# Altium schematic sheet Sheet_1_2023-04-21_Altium.schdoc
size 238 x 238 mm
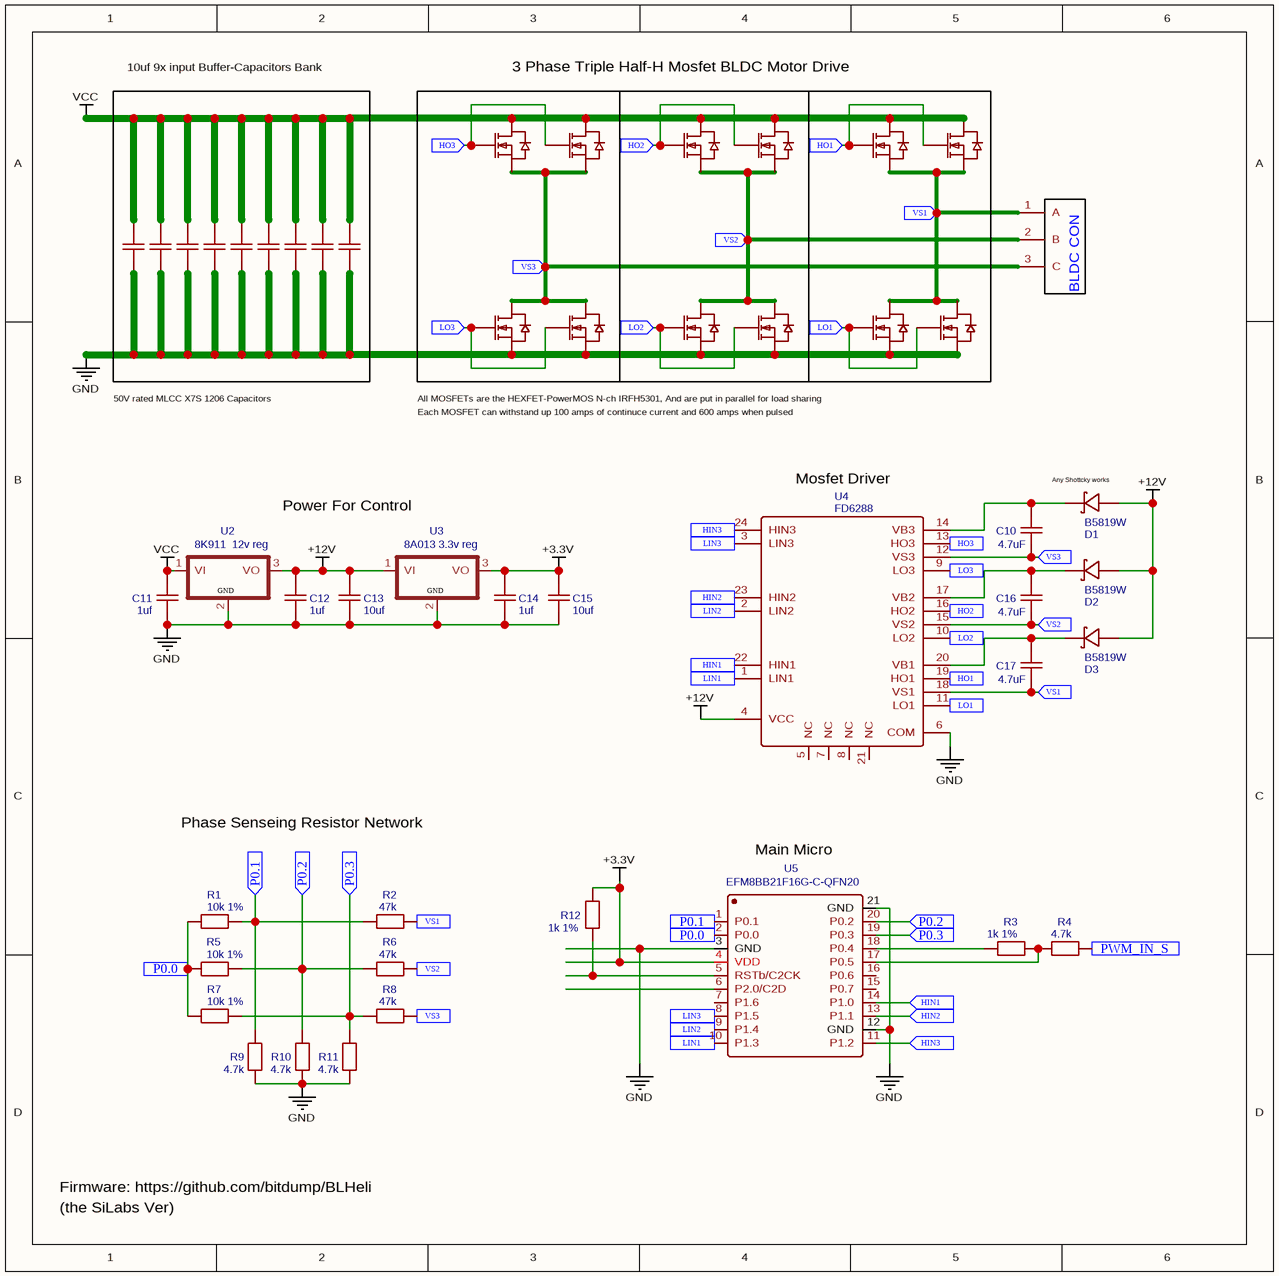
[diagram p0: Sheet_1_2023-04-21_Altium.schdoc]

## Parts
C1  10uf  [C0603]  (value not drawn)
C2  10uf  [C0603]  (value not drawn)
C3  10uf  [C0603]  (value not drawn)
C4  10uf  [C0603]  (value not drawn)
C5  10uf  [C0603]  (value not drawn)
C6  10uf  [C0603]  (value not drawn)
C7  10uf  [C0603]  (value not drawn)
C8  10uf  [C0603]  (value not drawn)
C9  10uf  [C0603]  (value not drawn)
C10  4.7uF  [C1206]
C11  1uf  [C0603]
C12  1uf  [C0603]
C13  10uf  [C0603]
C14  1uf  [C0603]
C15  10uf  [C0603]
C16  4.7uF  [C1206]
C17  4.7uF  [C1206]
D1  B5819W  [SOD-123_L2.8-W1.8-LS3.7-RD]
D2  B5819W  [SOD-123_L2.8-W1.8-LS3.7-RD]
D3  B5819W  [SOD-123_L2.8-W1.8-LS3.7-RD]
Q1  IRFH5301  [PQFN-5X6MM]  (value not drawn)
Q2  IRFH5301  [PQFN-5X6MM]  (value not drawn)
Q3  IRFH5301  [PQFN-5X6MM]  (value not drawn)
Q4  IRFH5301  [PQFN-5X6MM]  (value not drawn)
Q5  IRFH5301  [PQFN-5X6MM]  (value not drawn)
Q6  IRFH5301  [PQFN-5X6MM]  (value not drawn)
Q7  IRFH5301  [PQFN-5X6MM]  (value not drawn)
Q8  IRFH5301  [PQFN-5X6MM]  (value not drawn)
Q9  IRFH5301  [PQFN-5X6MM]  (value not drawn)
Q10  IRFH5301  [PQFN-5X6MM]  (value not drawn)
Q11  IRFH5301  [PQFN-5X6MM]  (value not drawn)
Q12  IRFH5301  [PQFN-5X6MM]  (value not drawn)
R1  10k 1%  [R0603]
R2  47k  [R0603]
R3  1k 1%  [R0603]
R4  4.7k  [R0603]
R5  10k 1%  [R0603]
R6  47k  [R0603]
R7  10k 1%  [R0603]
R8  47k  [R0603]
R9  4.7k  [R0603]
R10  4.7k  [R0603]
R11  4.7k  [R0603]
R12  1k 1%  [R0603]
U1  BLDC_CON  [BLDC_CON]  (value not drawn)
U2  8K911  12v reg  [PWRM-TH_K7805-2000L]
U3  8A013 3.3v reg  [PWRM-TH_K7805-2000L]
U4  FD6288  [TSSOP-20_L6.5-W4.4-P0.65-LS6.4-BL]
U5  EFM8BB21F16G-C-QFN20  [QFN-20_L3.0-W3.0-P0.50-BL-EP1.7_EFM8BB21F16G]

## Blocks framed on the sheet
10uf 9x input Buffer-Capacitors Bank: C1-C9
3 Phase Triple Half-H Mosfet BLDC Motor Drive: Q1 Q2 Q7 Q8

## Ports
HIN1 (in), HIN2 (in), HIN3 (in), HO1 (in), HO2 (in), HO3 (in), LIN1 (in), LIN2 (in), LIN3 (in), LO1 (in), LO2 (in), LO3 (in), P0.0 (in), P0.1 (in), P0.2 (in), P0.3 (in), PWM_IN_S (in), VS1 (in), VS2 (in), VS3 (in)

## Nets
+3.3V: C14.2 C15.2 R12.2 U3.3(VO) U5.4(VDD)
+12V: C12.2 C13.2 D1.2(A) D2.2(A) D3.2(A) U2.3(VO) U3.1(VI) U4.4(VCC)
GND: C1.1 C2.1 C3.1 C4.1 C5.1 C6.1 C7.1 C8.1 C9.1 C11.1 C12.1 C13.1 C14.1 C15.1 Q7.1(S) Q8.1(S) Q9.1(S) Q10.1(S) Q11.1(S) Q12.1(S) R9.1 R10.1 R11.1 U2.2(GND) U3.2(GND) U4.6(COM) U5.3(GND) U5.12(GND) U5.21(GND)
VCC: C1.2 C2.2 C3.2 C4.2 C5.2 C6.2 C7.2 C8.2 C9.2 C11.2 Q1.5(D) Q2.5(D) Q3.5(D) Q4.5(D) Q5.5(D) Q6.5(D) U2.1(VI)
HIN1: U4.22(HIN1) U5.14(P1.0) ; port HIN1
HIN2: U4.23(HIN2) U5.13(P1.1) ; port HIN2
HIN3: U4.24(HIN3) U5.11(P1.2) ; port HIN3
HO1: Q5.4(G) Q6.4(G) U4.19(HO1) ; port HO1
HO2: Q3.4(G) Q4.4(G) U4.16(HO2) ; port HO2
HO3: Q1.4(G) Q2.4(G) U4.13(HO3) ; port HO3
LIN1: U4.1(LIN1) U5.10(P1.3) ; port LIN1
LIN2: U4.2(LIN2) U5.9(P1.4) ; port LIN2
LIN3: U4.3(LIN3) U5.8(P1.5) ; port LIN3
LO1: Q11.4(G) Q12.4(G) U4.11(LO1) ; port LO1
LO2: Q9.4(G) Q10.4(G) U4.10(LO2) ; port LO2
LO3: Q7.4(G) Q8.4(G) U4.9(LO3) ; port LO3
P0.0: R1.2 R5.2 R7.2 U5.2(P0.0) ; port P0.0
P0.1: R1.1 R2.1 R9.2 U5.1(P0.1) ; port P0.1
P0.2: R5.1 R6.1 R10.2 U5.20(P0.2) ; port P0.2
P0.3: R7.1 R8.1 R11.2 U5.19(P0.3) ; port P0.3
PWM_IN_S: R4.2 ; port PWM_IN_S
VS1: C17.1 Q5.1(S) Q6.1(S) Q11.5(D) Q12.5(D) R2.2 U1.1(A) U4.18(VS1) ; port VS1
VS2: C16.1 Q3.1(S) Q4.1(S) Q9.5(D) Q10.5(D) R6.2 U1.2(B) U4.15(VS2) ; port VS2
VS3: C10.1 Q1.1(S) Q2.1(S) Q7.5(D) Q8.5(D) R8.2 U1.3(C) U4.12(VS3) ; port VS3
NetC10_2: C10.2 D1.1(K) U4.14(VB3)
NetC16_2: C16.2 D2.1(K) U4.17(VB2)
NetC17_2: C17.2 D3.1(K) U4.20(VB1)
NetR3_1: R3.1 U5.18(P0.4)
NetR3_2: R3.2 R4.1 U5.17(P0.5)
NetR12_1: R12.1 U5.5(RSTb/C2CK)

Not connected (* = marked no-connect by the designer): U4 5(NC) 7(NC) 8(NC) 21(NC); U5 6(P2.0/C2D) 7(P1.6) 15(P0.7) 16(P0.6)

## Notes on the sheet
- 50V rated MLCC X7S 1206 Capacitors
- All MOSFETs are the HEXFET-PowerMOS N-ch IRFH5301, And are put in parallel for load sharing
- Each MOSFET can withstand up 100 amps of continuce current and 600 amps when pulsed
- (near U4) Mosfet Driver
- (near D1) Any Shottcky works
- Power For Control
- Phase Senseing Resistor Network
- (near U5) Main Micro
- Firmware: https://github.com/bitdump/BLHeli
- (the SiLabs Ver)
- (in symbol BLDC_CON) BLDC CON

## Library data of the parts
C1-C9 C13 C15 = 10uf: nameAlias: Value(F); Contributor: LCEDA_Lib; spicePre: C; spiceSymbolName: C_0603_US
C10 C16 C17 = 4.7uF: BOM_Manufacturer: CCTC(三环); BOM_Manufacturer Part: TCC1206X5R475K160HT; nameAlias: Capacitance; Contributor: LCSC; BOM_Supplier: LCSC; BOM_Supplier Part: C380360; BOM_JLCPCB Part Class: Extended Part; spicePre: C; spiceSymbolName: TCC1206X5R475K160HT
C11 C12 C14 = 1uf: nameAlias: Value(F); Contributor: LCEDA_Lib; spicePre: C; spiceSymbolName: C_0603_US
D1-D3 = B5819W: BOM_Manufacturer: MDD; BOM_Supplier: LCSC; BOM_Manufacturer Part: B5819W; BOM_Supplier Part: C64885; BOM_JLCPCB Part Class: Extended Part; spicePre: D; spiceSymbolName: B5819W
Q1-Q12 = IRFH5301: BOM_Manufacturer: IR; BOM_Manufacturer Part: IRFH5301PbF; Contributor: maseratiolli; BOM_Supplier Part: C82057; BOM_Supplier: LCSC; spicePre: Q; spiceSymbolName: IRFH5301
R1 R5 R7 = 10k 1%: nameAlias: Value(Ω); Contributor: LCEDA_Lib; spicePre: R; spiceSymbolName: R_0603_EU
R2 R6 R8 = 47k: nameAlias: Value(Ω); Contributor: LCEDA_Lib; spicePre: R; spiceSymbolName: R_0603_EU
R3 R12 = 1k 1%: nameAlias: Value(Ω); Contributor: LCEDA_Lib; spicePre: R; spiceSymbolName: R_0603_EU
R4 R9-R11 = 4.7k: nameAlias: Value(Ω); Contributor: LCEDA_Lib; spicePre: R; spiceSymbolName: R_0603_EU
U1 = BLDC_CON: Contributor: masroorkhan; spicePre: U; spiceSymbolName: BLDC_CON
U2 = 8K911  12v reg: BOM_Manufacturer: MORNSUN(金升阳); BOM_Manufacturer Part: K7805-2000L; Contributor: LCSC; BOM_Supplier: LCSC; BOM_Supplier Part: C96398; BOM_JLCPCB Part Class: Extended Part; spicePre: U; spiceSymbolName: K7805-2000L
U3 = 8A013 3.3v reg: BOM_Manufacturer: MORNSUN(金升阳); BOM_Manufacturer Part: K7805-2000L; Contributor: LCSC; BOM_Supplier: LCSC; BOM_Supplier Part: C96398; BOM_JLCPCB Part Class: Extended Part; spicePre: U; spiceSymbolName: K7805-2000L
U4 = FD6288: BOM_Manufacturer: Fortior Tech(峰岹); BOM_Manufacturer Part: FD6288T; Contributor: MazenGomaa; BOM_Supplier: LCSC; BOM_Supplier Part: C97683; BOM_JLCPCB Part Class: Extended Part; spicePre: U; spiceSymbolName: FD6288
U5 = EFM8BB21F16G-C-QFN20: BOM_Manufacturer: SILICON LABS; BOM_Manufacturer Part: EFM8BB21F16A-C-QFN20; Contributor: LCSC; BOM_Supplier: LCSC; BOM_Supplier Part: C430129; BOM_JLCPCB Part Class: Extended Part; spicePre: U; spiceSymbolName: EFM8BB21F16A-C-QFN20